# EAGLE design board (EAGLE 9.6.2)
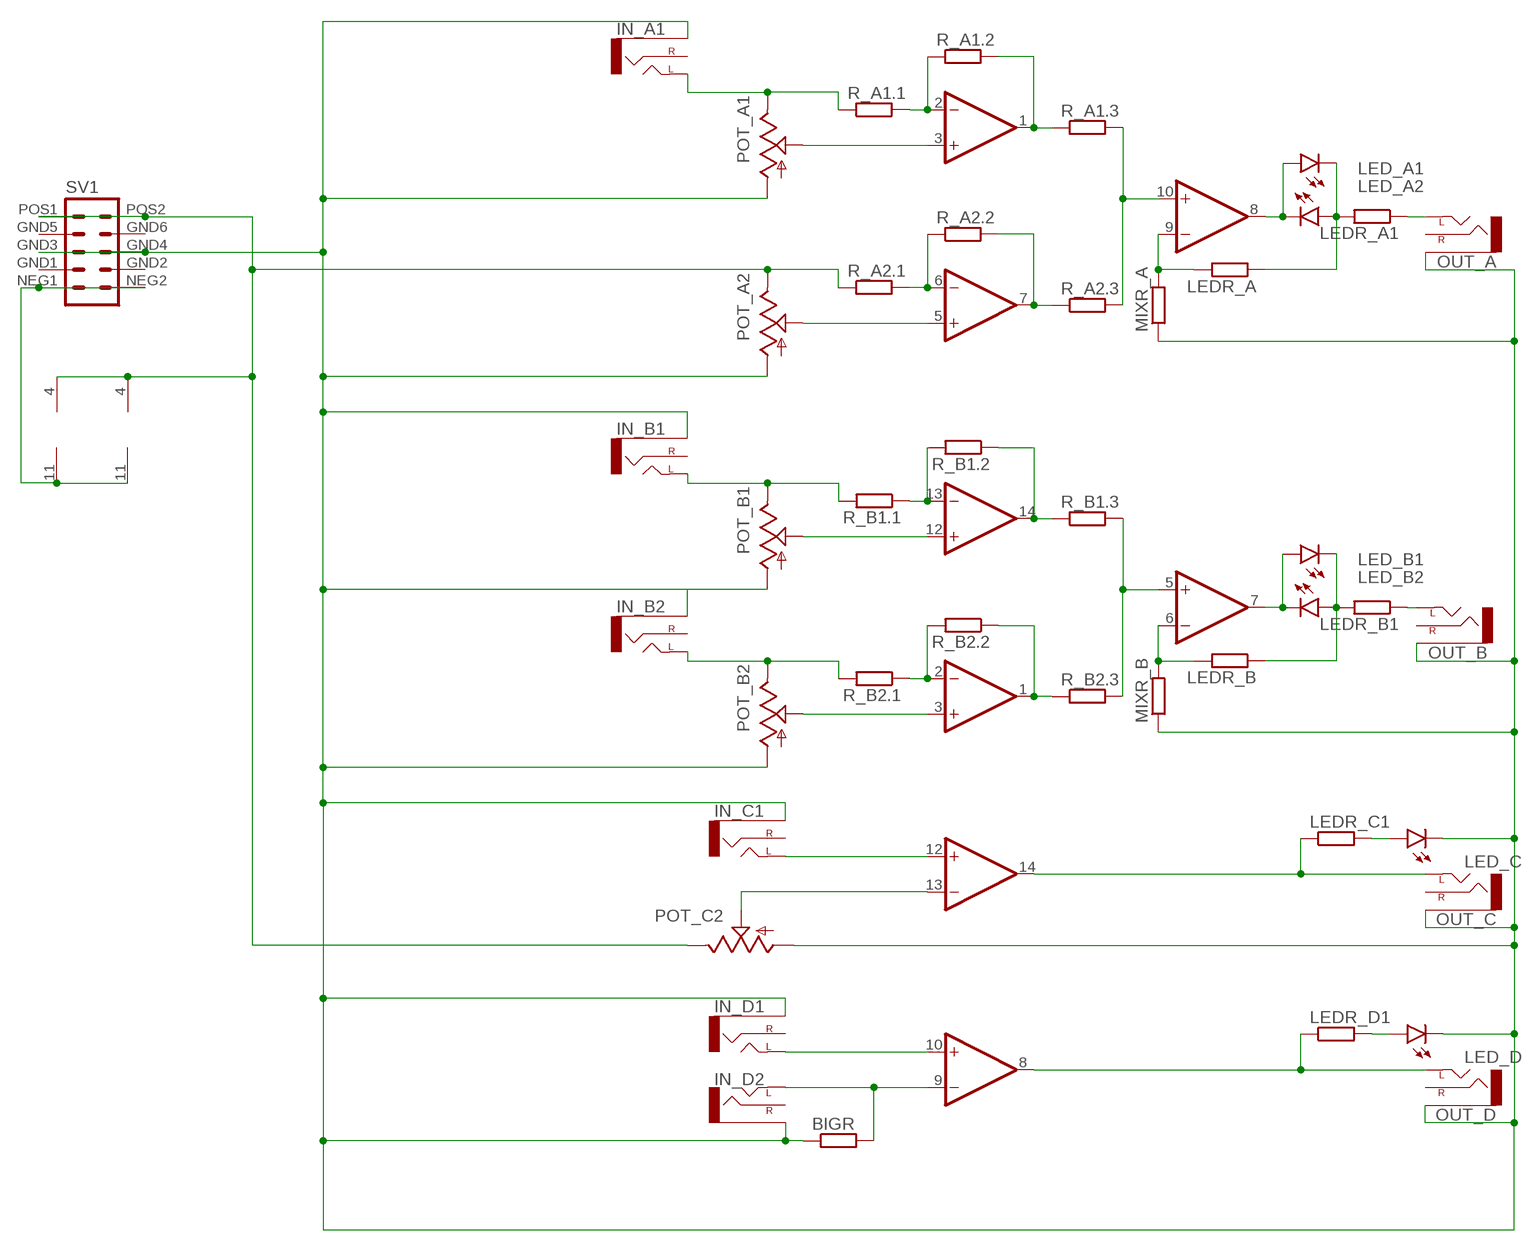
[diagram p0: schematic, sheet 1]

## Parts
BIGR  RESISTOR7MM  [7MM_RESISTOR]
IC1  TL074P  [DIL14]
IC2  TL074P  [DIL14]
IN_A1  THONKI-STEREO  [WQP-PJ366ST_JACK]
IN_B1  THONKI-STEREO  [WQP-PJ366ST_JACK]
IN_B2  THONKI-STEREO  [WQP-PJ366ST_JACK]
IN_C1  THONKI-STEREO  [WQP-PJ366ST_JACK]
IN_D1  THONKI-STEREO  [WQP-PJ366ST_JACK]
IN_D2  THONKI-STEREO  [WQP-PJ366ST_JACK]
LED_A1  LED3MM  [LED_3MM]
LED_A2  LED3MM  [LED_3MM]
LED_B1  LED3MM  [LED_3MM]
LED_B2  LED3MM  [LED_3MM]
LED_C  LED3MM  [LED_3MM]
LED_D  LED3MM  [LED_3MM]
LEDR_A  RESISTOR7MM  [7MM_RESISTOR]
LEDR_A1  RESISTOR7MM  [7MM_RESISTOR]
LEDR_B  RESISTOR7MM  [7MM_RESISTOR]
LEDR_B1  RESISTOR7MM  [7MM_RESISTOR]
LEDR_C1  RESISTOR7MM  [7MM_RESISTOR]
LEDR_D1  RESISTOR7MM  [7MM_RESISTOR]
MIXR_A  RESISTOR7MM  [7MM_RESISTOR]
MIXR_B  RESISTOR7MM  [7MM_RESISTOR]
OUT_A  THONKI-STEREO  [WQP-PJ366ST_JACK]
OUT_B  THONKI-STEREO  [WQP-PJ366ST_JACK]
OUT_C  THONKI-STEREO  [WQP-PJ366ST_JACK]
OUT_D  THONKI-STEREO  [WQP-PJ366ST_JACK]
POT_A1  9MM_SNAP-IN_POT_  [9MM_SNAP-IN_POT]
POT_A2  9MM_SNAP-IN_POT_  [9MM_SNAP-IN_POT]
POT_B1  9MM_SNAP-IN_POT_  [9MM_SNAP-IN_POT]
POT_B2  9MM_SNAP-IN_POT_  [9MM_SNAP-IN_POT]
POT_C2  9MM_SNAP-IN_POT_  [9MM_SNAP-IN_POT]
R_A1.1  RESISTOR7MM  [7MM_RESISTOR]
R_A1.2  RESISTOR7MM  [7MM_RESISTOR]
R_A1.3  RESISTOR7MM  [7MM_RESISTOR]
R_A2.1  RESISTOR7MM  [7MM_RESISTOR]
R_A2.2  RESISTOR7MM  [7MM_RESISTOR]
R_A2.3  RESISTOR7MM  [7MM_RESISTOR]
R_B1.1  RESISTOR7MM  [7MM_RESISTOR]
R_B1.2  RESISTOR7MM  [7MM_RESISTOR]
R_B1.3  RESISTOR7MM  [7MM_RESISTOR]
R_B2.1  RESISTOR7MM  [7MM_RESISTOR]
R_B2.2  RESISTOR7MM  [7MM_RESISTOR]
R_B2.3  RESISTOR7MM  [7MM_RESISTOR]
SV1  EURO_POWER_HEADERLOCK_PADS  [EURO_PWR_HEADER_LOCK]

## Nets
N$1: LED_A1.K(C) LED_A2.A LEDR_A1.2 LEDR_A.1
N$2: IC2.6(B:-IN) LEDR_B.2 MIXR_B.2
N$3: LED_C.A LEDR_C1.2
N$4: IC2.14(D:OUT) LEDR_C1.1 OUT_C.P$1_TIP(LEFT)
N$5: IC1.12(D:+IN) POT_B1.2(S)
N$6: IC1.4(P:V+) IC2.4(P:V+) POT_A2.3(E) POT_C2.3(E) R_A2.1.1 SV1.POS1 SV1.POS2
N$7: IC1.11(P:V-) IC2.11(P:V-) SV1.NEG1 SV1.NEG2
N$8: IC2.13(D:-IN) POT_C2.2(S)
N$9: IC2.12(D:+IN) IN_C1.P$1_TIP(LEFT)
N$10: IC2.10(C:+IN) IN_D1.P$1_TIP(LEFT)
N$11: BIGR.2 IC2.9(C:-IN) IN_D2.P$1_TIP(LEFT)
N$12: IC2.8(C:OUT) LEDR_D1.1 OUT_D.P$1_TIP(LEFT)
N$13: LED_D.A LEDR_D1.2
N$14: LED_B1.K(C) LED_B2.A LEDR_B1.2 LEDR_B.1
N$15: IC2.5(B:+IN) R_B1.3.2 R_B2.3.2
N$16: IC2.1(A:OUT) R_B2.2.1 R_B2.3.1
N$17: IC1.14(D:OUT) R_B1.2.1 R_B1.3.1
N$18: IC1.10(C:+IN) R_A1.3.2 R_A2.3.2
N$19: IC1.7(B:OUT) R_A2.2.2 R_A2.3.1
N$20: IC1.1(A:OUT) R_A1.2.2 R_A1.3.1
N$21: IC1.3(A:+IN) POT_A1.2(S)
N$22: IC1.5(B:+IN) POT_A2.2(S)
N$23: IN_A1.P$1_TIP(LEFT) POT_A1.3(E) R_A1.1.1
N$24: IC1.2(A:-IN) R_A1.1.2 R_A1.2.1
N$25: IC1.6(B:-IN) R_A2.1.2 R_A2.2.1
N$26: IC1.9(C:-IN) LEDR_A.2 MIXR_A.2
N$27: IC1.8(C:OUT) LED_A1.A LED_A2.K(C)
N$28: LEDR_A1.1 OUT_A.P$1_TIP(LEFT)
N$29: IC2.3(A:+IN) POT_B2.2(S)
N$30: IN_B1.P$1_TIP(LEFT) POT_B1.3(E) R_B1.1.2
N$31: IN_B2.P$1_TIP(LEFT) POT_B2.3(E) R_B2.1.2
N$32: IC2.2(A:-IN) R_B2.1.1 R_B2.2.2
N$33: IC1.13(D:-IN) R_B1.1.1 R_B1.2.2
N$34: IC2.7(B:OUT) LED_B1.A LED_B2.K(C)
N$36: BIGR.1 IN_A1.P$3_SLEEVE(SLEEVE) IN_B1.P$3_SLEEVE(SLEEVE) IN_B2.P$3_SLEEVE(SLEEVE) IN_C1.P$3_SLEEVE(SLEEVE) IN_D1.P$3_SLEEVE(SLEEVE) IN_D2.P$3_SLEEVE(SLEEVE) LED_C.K(C) LED_D.K(C) MIXR_A.1 MIXR_B.1 OUT_A.P$3_SLEEVE(SLEEVE) OUT_B.P$3_SLEEVE(SLEEVE) OUT_C.P$3_SLEEVE(SLEEVE) OUT_D.P$3_SLEEVE(SLEEVE) POT_A1.1(A) POT_A2.1(A) POT_B1.1(A) POT_B2.1(A) POT_C2.1(A) SV1.GND3 SV1.GND4
N$38: LEDR_B1.1 OUT_B.P$1_TIP(LEFT)
Unconnected: IN_A1.P$2_SWITCH(RIGHT) IN_B1.P$2_SWITCH(RIGHT) IN_B2.P$2_SWITCH(RIGHT) IN_C1.P$2_SWITCH(RIGHT) IN_D1.P$2_SWITCH(RIGHT) IN_D2.P$2_SWITCH(RIGHT) OUT_A.P$2_SWITCH(RIGHT) OUT_B.P$2_SWITCH(RIGHT) OUT_C.P$2_SWITCH(RIGHT) OUT_D.P$2_SWITCH(RIGHT) SV1.GND1 SV1.GND2 SV1.GND5 SV1.GND6

## Library data of the parts
BIGR LEDR_A LEDR_A1 LEDR_B LEDR_B1 LEDR_C1 LEDR_D1 MIXR_A MIXR_B R_A1.1-R_A1.3 R_A2.1-R_A2.3 R_B1.1-R_B1.3 R_B2.1-R_B2.3 = MusicThingModular:RESISTOR: Standard resistor, various versions
IC1 IC2 = linear:TL074: OP AMP
IN_A1 IN_B1 IN_B2 IN_C1 IN_D1 IN_D2 OUT_A OUT_B OUT_C OUT_D = MusicThingModular:THONKI-STEREO: 3.5mm socket for Eurorack modular synths
LED_A1 LED_A2 LED_B1 LED_B2 LED_C LED_D = SparkFun-LED:LED: LED (Generic) Standard schematic elements and footprints for 5mm, 3mm, 1206, and 0603 sized LEDs. Generic LEDs with no color specified.; PROD_ID: DIO-08794
POT_A1 POT_A2 POT_B1 POT_B2 POT_C2 = MusicThingModular:9MM_SNAP-IN_POT: 9mm vertical snap-in pot, Alpha / Panasonic style
SV1 = MusicThingModular:EURO_POWER_HEADER: Power Header 10 pin power header for Eurorack Power Supplies Variants with fatter pads for easier soldering, and the LOCK variant which has 5mil offset pins to hold the component in place before soldering

## Board
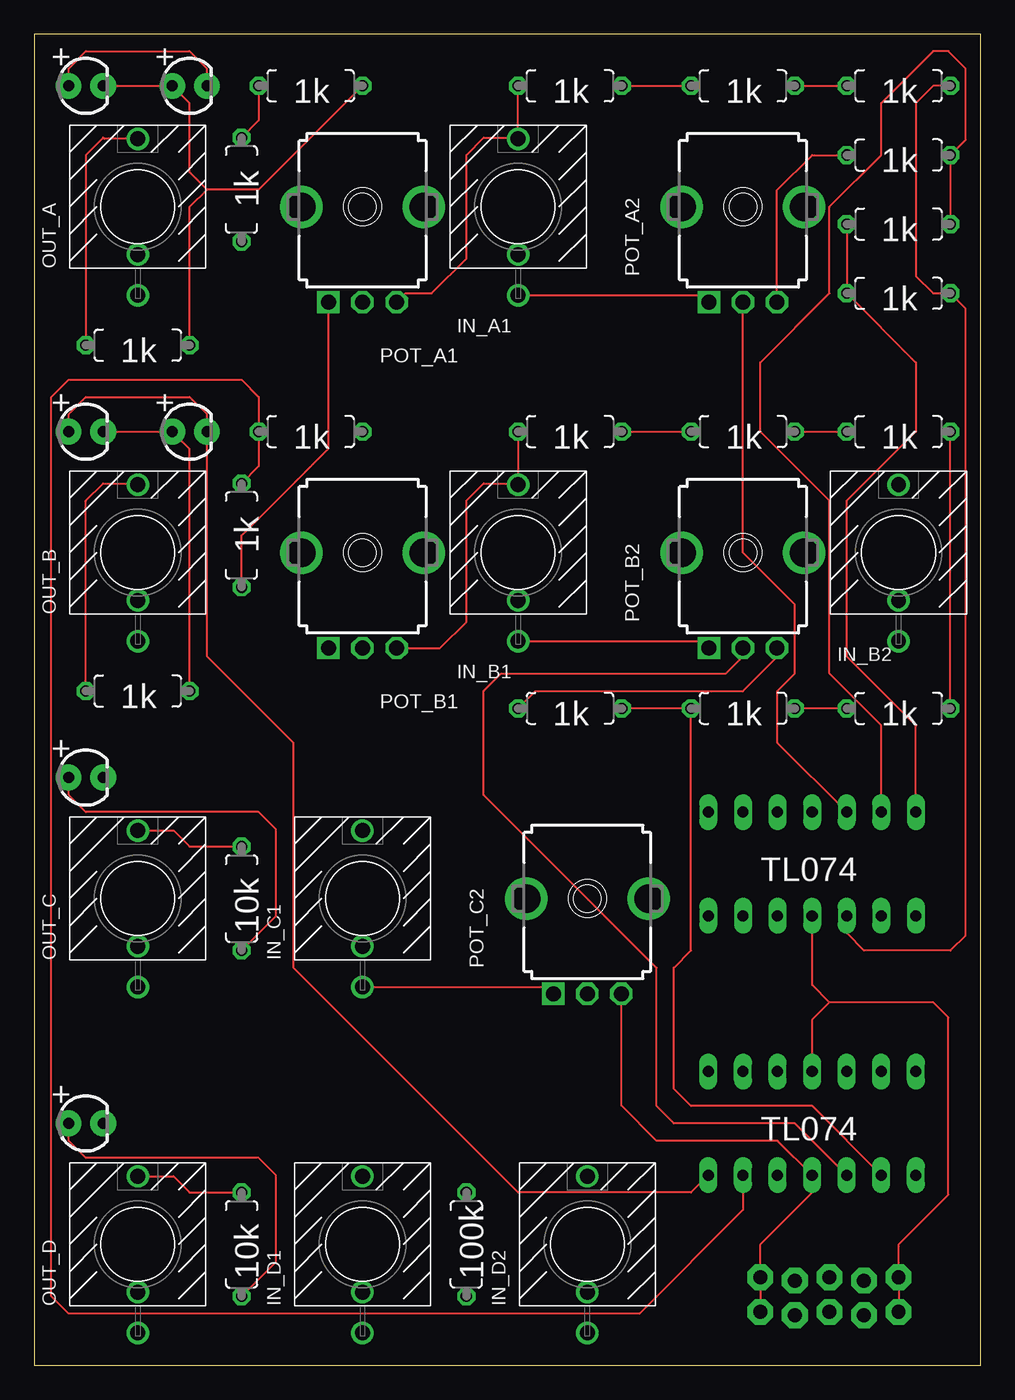
[diagram p1: board, top side]
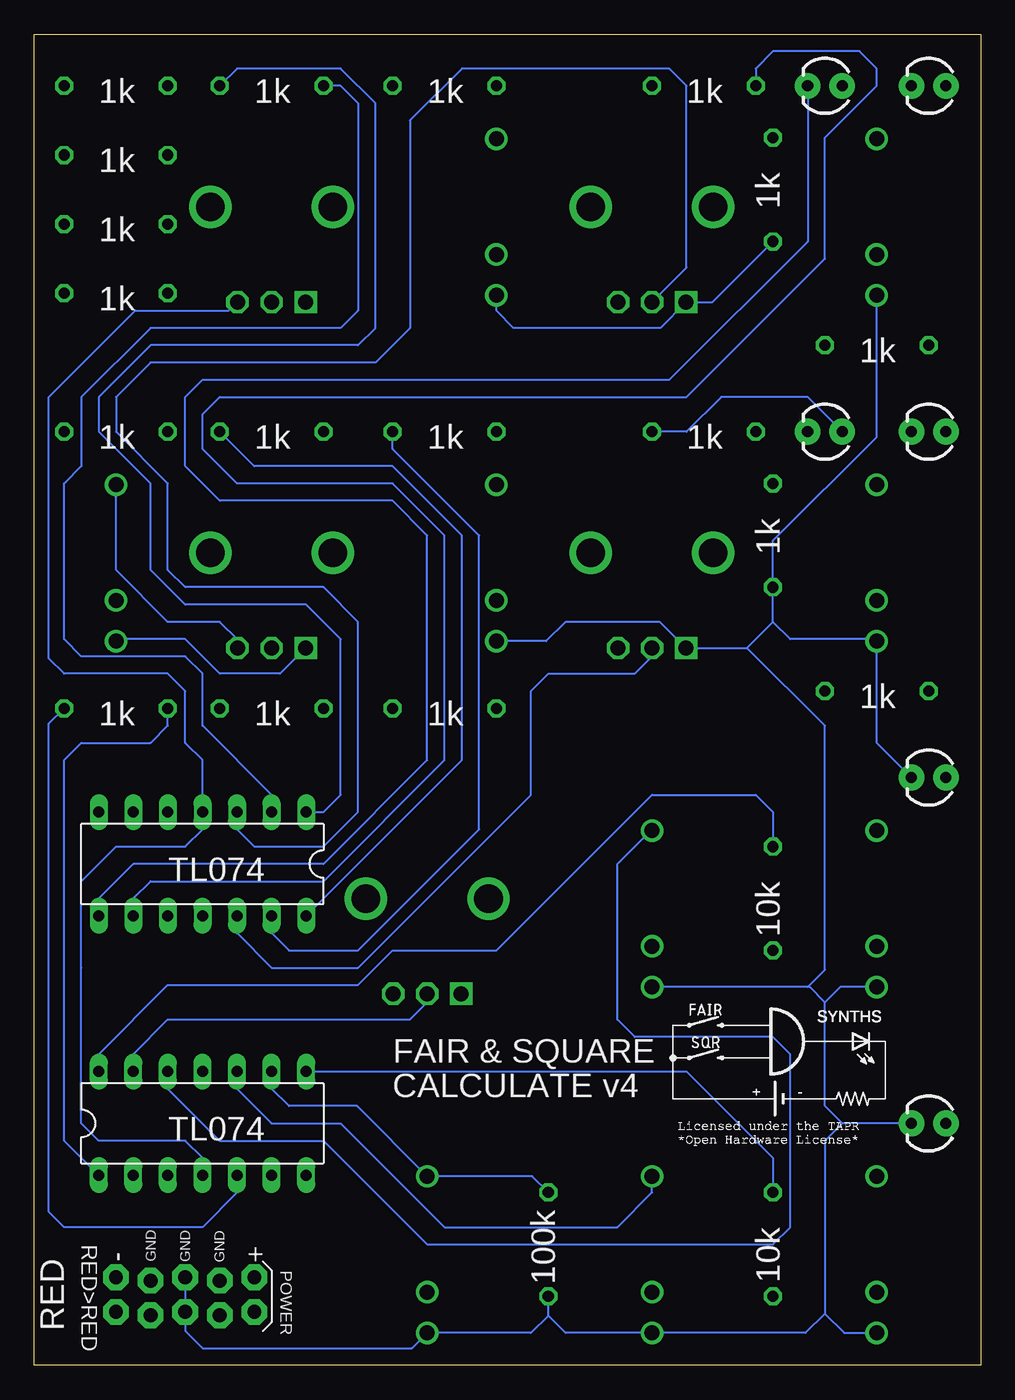
[diagram p2: board, bottom side, seen from below]

Size 69.52 x 97.78 mm. Coordinates in mm from the lower left corner, seen from the top.
Outline: 0,0 69.52,0 69.52,97.78 0,97.78 0,0
Copper layers (1*16): Top 0.035mm / dielectric 1.5mm / Bottom 0.035mm
Design rules "default": minimum track width 6mil, minimum drill 0.35mm, track to track 6mil, track to pad 6mil, pad to pad 6mil, via to via 6mil, smd to smd 6mil, copper to edge 40mil, drill to drill 6mil, minimum pad ring 10mil, minimum via ring 8mil, stop-mask expansion 4mil, vias tented up to drill 0mil, thermal gap 10mil

### Footprints (pad centres in the part's own frame; a part is rotated, then mirrored left to right if it is on the bottom)
7MM_RESISTOR = drill 0.813 octagon: 1 -3.81,0; 2 3.81,0
DIL14 = drill 0.813 long: 1 -7.62,-3.81; 2 -5.08,-3.81; 3 -2.54,-3.81; 4 0,-3.81; 5 2.54,-3.81; 6 5.08,-3.81; 7 7.62,-3.81; 8 7.62,3.81; 9 5.08,3.81; 10 2.54,3.81; 11 0,3.81; 12 -2.54,3.81; 13 -5.08,3.81; 14 -7.62,3.81
WQP-PJ366ST_JACK = drill 1.1: P$1_TIP 0,5; P$2_SWITCH 0,-3.5; P$3_SLEEVE 0,-6.5
LED_3MM = drill 0.813 pad 1.88: A -1.27,0; K 1.27,0
9MM_SNAP-IN_POT = drill 1.1 square: 1 -2.5,-7 | drill 1.1 octagon: 2 0,-7; 3 2.5,-7 | drill 2.1 pad 2.794: CHASSIS1 -4.5,0; CHASSIS2 4.5,0
EURO_PWR_HEADER_LOCK = drill 1.016 pad 1.88 octagon: GND1 -2.54,1.143; GND2 -2.54,-1.397; GND3 0,1.397; GND4 0,-1.143; GND5 2.54,1.143; GND6 2.54,-1.397; NEG1 -5.08,1.397; NEG2 -5.08,-1.143; POS1 5.08,1.397; POS2 5.08,-1.143

### Placement (x,y rotation side)
BIGR  31.75,8.89 90 top
IC1  57.15,36.83 180 bottom
IC2  57.15,17.78 0 bottom
IN_A1  35.56,85.09 0 top
IN_B1  35.56,59.69 0 top
IN_B2  63.5,59.69 0 top
IN_C1  24.13,34.29 0 top
IN_D1  24.13,8.89 0 top
IN_D2  40.64,8.89 0 top
LED_A1  3.81,93.98 0 top
LED_A2  11.43,93.98 0 top
LED_B1  3.81,68.58 0 top
LED_B2  11.43,68.58 0 top
LED_C  3.81,43.18 0 top
LED_D  3.81,17.78 0 top
LEDR_A  20.32,93.98 180 top
LEDR_A1  7.62,74.93 0 top
LEDR_B  20.32,68.58 180 top
LEDR_B1  7.62,49.53 0 top
LEDR_C1  15.24,34.29 270 top
LEDR_D1  15.24,8.89 270 top
MIXR_A  15.24,86.36 90 top
MIXR_B  15.24,60.96 90 top
OUT_A  7.62,85.09 0 top
OUT_B  7.62,59.69 0 top
OUT_C  7.62,34.29 0 top
OUT_D  7.62,8.89 0 top
POT_A1  24.13,85.09 0 top
POT_A2  52.07,85.09 0 top
POT_B1  24.13,59.69 0 top
POT_B2  52.07,59.69 0 top
POT_C2  40.64,34.29 0 top
R_A1.1  39.37,93.98 0 top
R_A1.2  52.07,93.98 0 top
R_A1.3  63.5,93.98 0 top
R_A2.1  63.5,88.9 0 top
R_A2.2  63.5,83.82 180 top
R_A2.3  63.5,78.74 0 top
R_B1.1  39.37,68.58 180 top
R_B1.2  52.07,68.58 180 top
R_B1.3  63.5,68.58 0 top
R_B2.1  39.37,48.26 180 top
R_B2.2  52.07,48.26 180 top
R_B2.3  63.5,48.26 0 top
SV1  58.42,5.08 0 bottom

### Tracks (layer width: path | path; a pad name or v marks a point on that pad's centre or on a via)
N$1
  Top 0.152: LED_A1.K LED_A2.A 11.43,92.71 11.43,87.63 12.7,86.36 | LEDR_A1.2 11.43,85.09 12.7,86.36 | LEDR_A.1 16.51,86.36 12.7,86.36
N$2
  Top 0.152: IC2.6 52.07,11.43 44.45,3.81 2.54,3.81 1.27,5.08 1.27,71.12 2.54,72.39 15.24,72.39 16.51,71.12 LEDR_B.2 16.51,66.04 MIXR_B.2
N$3
  Top 0.152: LEDR_C1.2 17.78,33.02 17.78,39.37 16.51,40.64 3.81,40.64 2.54,41.91 LED_C.A
N$4
  Top 0.152: OUT_C.P$1_TIP 10.24,39.29 11.43,38.1 LEDR_C1.1
  Bottom 0.152: IC2.14 64.77,22.86 59.69,27.94 45.72,27.94 43.18,30.48 35.56,30.48 24.13,41.91 16.51,41.91 15.24,40.64 LEDR_C1.1
N$5
  Bottom 0.152: POT_B1.2 24.13,52.07 25.4,50.8 31.75,50.8 33.02,49.53 33.02,41.91 45.72,29.21 52.07,29.21 54.61,31.75 IC1.12
N$6
  Top 0.152: POT_A2.3 54.57,86.32 57.15,88.9 R_A2.1.1 | POT_C2.3 43.14,19.09 45.72,16.51 54.61,16.51 IC2.4 57.15,12.7 53.34,8.89 SV1.POS1 SV1.POS2
  Bottom 0.152: POT_A2.3 54.61,78.09 55.23,77.47 62.08,77.47 68.43,71.12 68.43,51.92 67.31,50.8 59.69,50.8 58.42,49.53 58.42,45.72 57.15,44.45 IC1.4 57.15,39.37 58.42,38.1 63.5,38.1 66.04,35.56 66.04,29.21 66.04,17.78 64.77,16.51 58.42,16.51 57.15,15.24 IC2.4
N$7
  Top 0.152: SV1.NEG2 SV1.NEG1 63.5,8.89 67.16,12.55 67.16,25.55 66.04,26.67 58.42,26.67 | IC2.11 57.15,25.4 58.42,26.67 | IC1.11 57.15,27.94 58.42,26.67
N$8
  Bottom 0.152: IC2.13 62.23,22.86 59.69,25.4 41.91,25.4 40.64,26.67 POT_C2.2
N$9
  Bottom 0.152: IC2.12 59.69,20.32 55.88,16.51 48.26,16.51 40.64,8.89 15.24,8.89 13.97,10.16 13.97,22.86 15.24,24.13 25.4,24.13 26.67,25.4 26.67,36.83 24.21,39.29 IN_C1.P$1_TIP
N$10
  Bottom 0.152: IC2.10 54.61,20.32 52.07,17.78 46.99,17.78 39.37,10.16 26.67,10.16 24.13,12.7 IN_D1.P$1_TIP
N$11
  Bottom 0.152: IC2.9 52.07,20.32 50.8,19.05 45.8,19.05 IN_D2.P$1_TIP 32.94,13.89 BIGR.2
N$12
  Top 0.152: OUT_D.P$1_TIP 10.24,13.89 11.43,12.7 LEDR_D1.1
  Bottom 0.152: IC2.8 21.59,21.59 15.24,15.24 LEDR_D1.1
N$13
  Top 0.152: LEDR_D1.2 17.78,7.62 17.78,13.97 16.51,15.24 3.81,15.24 2.54,16.51 LED_D.A
N$14
  Top 0.152: LED_B1.K LED_B2.A 11.43,67.31 LEDR_B1.2
  Bottom 0.152: LED_B2.A 12.7,71.12 19.05,71.12 21.59,68.58 LEDR_B.1
N$15
  Top 0.152: R_B2.3.2 R_B1.3.2
  Bottom 0.152: IC2.5 54.61,12.7 57.15,10.16 67.31,10.16 68.43,11.28 68.43,47.14 R_B2.3.2
N$16
  Top 0.152: R_B2.3.1 R_B2.2.1
  Bottom 0.152: IC2.1 67.31,16.51 67.31,44.45 66.04,45.72 60.96,45.72 59.69,46.99 R_B2.3.1
N$17
  Top 0.152: R_B1.2.1 R_B1.3.1
  Bottom 0.152: R_B1.2.1 53.34,66.04 43.18,66.04 38.1,60.96 38.1,44.45 IC1.14
N$18
  Top 0.152: R_A1.3.2 66.04,93.98 64.77,92.71 64.77,80.01 66.04,78.74 R_A2.3.2 68.43,77.62 68.43,36.83 68.43,31.6 67.31,30.48 60.96,30.48 59.69,31.75 IC1.10
N$19
  Top 0.152: R_A2.2.2 R_A2.3.1 64.77,73.66 64.77,68.58 59.69,63.5 59.69,52.07 64.77,46.99 IC1.7
N$20
  Top 0.152: R_A1.2.2 R_A1.3.1
  Bottom 0.152: R_A1.2.2 54.61,95.25 46.99,95.25 44.45,92.71 44.45,76.2 45.72,74.93 60.96,74.93 64.77,71.12 64.77,68.58 60.96,64.77 60.96,58.42 58.42,55.88 49.53,55.88 46.99,53.34 46.99,41.91 48.26,40.64 IC1.1
N$21
  Bottom 0.152: POT_A1.2 21.59,80.63 21.59,93.98 22.86,95.25 38.1,95.25 41.91,91.44 41.91,76.2 44.45,73.66 60.96,73.66 63.5,71.12 63.5,68.58 59.69,64.77 59.69,58.42 58.42,57.15 48.26,57.15 45.72,54.61 45.72,40.64 48.26,38.1 53.34,38.1 54.61,39.37 IC1.3
N$22
  Top 0.152: IC1.5 54.61,45.72 54.61,49.53 55.88,50.8 55.88,55.88 52.07,59.69 POT_A2.2
N$23
  Top 0.152: IN_A1.P$1_TIP 35.56,90.17 | 35.56,90.17 R_A1.1.1 | POT_A1.3 27.28,78.74 29.21,78.74 31.75,81.28 31.75,88.9 33.02,90.17 35.56,90.17
N$24
  Top 0.152: R_A1.1.2 R_A1.2.1
  Bottom 0.152: R_A1.2.1 46.99,93.98 45.72,92.71 45.72,77.47 46.99,76.2 60.96,76.2 66.04,71.12 66.04,66.04 67.31,64.77 67.31,53.34 66.04,52.07 58.42,52.07 57.15,50.8 57.15,46.99 52.07,41.91 IC1.2
N$25
  Top 0.152: R_A2.2.1 R_A2.1.2 68.43,90.02 68.43,95.25 67.16,96.52 66.04,96.52 62.23,92.71 62.23,88.9 58.42,85.09 58.42,78.74 53.34,73.66 53.34,68.58 58.42,63.5 58.42,50.8 62.23,46.99 IC1.6
N$26
  Top 0.152: LEDR_A.2 16.51,91.44 MIXR_A.2
  Bottom 0.152: IC1.9 62.23,34.29 60.96,35.56 48.26,35.56 39.37,44.45 39.37,60.96 43.18,64.77 54.61,64.77 57.15,67.31 57.15,69.85 55.88,71.12 21.59,71.12 11.43,81.28 11.43,90.17 7.62,93.98 7.62,95.25 8.89,96.52 15.24,96.52 16.51,95.25 LEDR_A.2
N$27
  Top 0.152: LED_A1.A 2.54,95.25 3.81,96.52 11.43,96.52 12.7,95.25 LED_A2.K
  Bottom 0.152: IC1.8 64.77,34.29 62.23,36.83 48.26,36.83 40.64,44.45 40.64,60.96 43.18,63.5 55.88,63.5 58.42,66.04 58.42,71.12 57.15,72.39 22.86,72.39 12.7,82.55 LED_A2.K
N$28
  Top 0.152: OUT_A.P$1_TIP 5.16,90.09 5.08,90.17 3.81,88.9 LEDR_A1.1
N$29
  Top 0.152: IC2.3 55.88,17.78 46.99,17.78 45.72,19.05 45.72,29.21 33.02,41.91 33.02,49.53 34.29,50.8 50.8,50.8 52.07,52.07 POT_B2.2
N$30
  Top 0.152: R_B1.1.2 35.56,64.77 | 35.56,64.77 IN_B1.P$1_TIP | POT_B1.3 29.83,52.69 31.75,54.61 31.75,63.5 33.02,64.77 35.56,64.77
N$31
  Top 0.152: R_B2.1.2 36.83,49.53 52.07,49.53 54.57,52.03 POT_B2.3
  Bottom 0.152: POT_B2.3 54.57,53.3 55.88,54.61 59.69,54.61 63.5,58.42 IN_B2.P$1_TIP
N$32
  Top 0.152: R_B2.1.1 R_B2.2.2 48.26,30.48 46.99,29.21 46.99,20.32 48.26,19.05 57.15,19.05 IC2.2
N$33
  Top 0.152: R_B1.1.1 R_B1.2.2
  Bottom 0.152: R_B1.1.1 43.18,67.31 36.83,60.96 36.83,39.37 45.72,30.48 50.8,30.48 52.07,31.75 IC1.13
N$34
  Top 0.152: LED_B1.A 2.54,69.85 3.81,71.12 11.43,71.12 12.7,69.85 LED_B2.K 12.7,52.07 19.05,45.72 19.05,29.21 35.56,12.7 48.26,12.7 IC2.7
N$36
  Top 0.152: IN_C1.P$3_SLEEVE 37.64,27.79 POT_C2.1 | IN_A1.P$3_SLEEVE 49.07,78.59 POT_A2.1 | IN_B1.P$3_SLEEVE 49.07,53.19 POT_B2.1 | MIXR_B.1 15.24,60.96 21.63,67.35 POT_A1.1
  Bottom 0.152: 15.24,54.61 13.97,53.34 7.77,53.34 OUT_B.P$3_SLEEVE 7.62,45.72 LED_C.K | 15.24,54.61 MIXR_B.1 15.24,60.58 7.62,68.2 OUT_A.P$3_SLEEVE | 17.14,52.7 17.16,52.69 POT_B1.1 23.55,54.61 30.48,54.61 31.9,53.19 IN_B1.P$3_SLEEVE | 17.14,52.7 15.24,54.61 | IN_A1.P$3_SLEEVE 35.56,77.47 34.29,76.2 23.52,76.2 POT_A1.1 19.7,78.09 MIXR_A.1 | POT_B2.1 51.46,50.8 55.88,50.8 58.42,53.34 63.35,53.34 IN_B2.P$3_SLEEVE | SV1.GND3 SV1.GND4 58.42,2.54 57.15,1.27 41.76,1.27 IN_D2.P$3_SLEEVE 33.02,2.39 31.75,3.66 | 31.75,3.66 30.48,2.39 IN_D1.P$3_SLEEVE 12.85,2.39 11.43,3.81 | 31.75,3.66 BIGR.1 | 11.43,26.67 11.43,19.05 10.16,17.78 | 10.16,17.78 11.43,16.51 11.43,3.81 | OUT_D.P$3_SLEEVE 10.01,2.39 11.43,3.81 | LED_D.K 10.16,17.78 | 11.43,26.67 12.55,27.79 12.7,27.79 | 12.7,27.79 IN_C1.P$3_SLEEVE | OUT_C.P$3_SLEEVE 10.31,27.79 11.43,26.67 | 12.7,27.79 11.43,29.06 11.43,46.99 17.14,52.7
N$38
  Top 0.152: LEDR_B1.1 3.81,63.5 5.08,64.77 7.54,64.77 OUT_B.P$1_TIP

### Text on the board
tPlace: + | + | 1k | 1k | 1k | 1k | 1k | 1k | 1k | 1k | 1k | + | + | 1k | 1k | 1k | 1k | 1k | 1k | 1k | 1k | 1k | + | TL074 | 10k | + | TL074 | 10k | 100k
bPlace: 1k | 1k | 1k | 1k | 1k | 1k | 1k | 1k | 1k | 1k | 1k | 1k | 1k | 1k | 1k | 1k | 1k | 1k | 10k | TL074 | FAIR & SQUARE | CALCULATE v4 | TL074 | 100k | 10k | RED